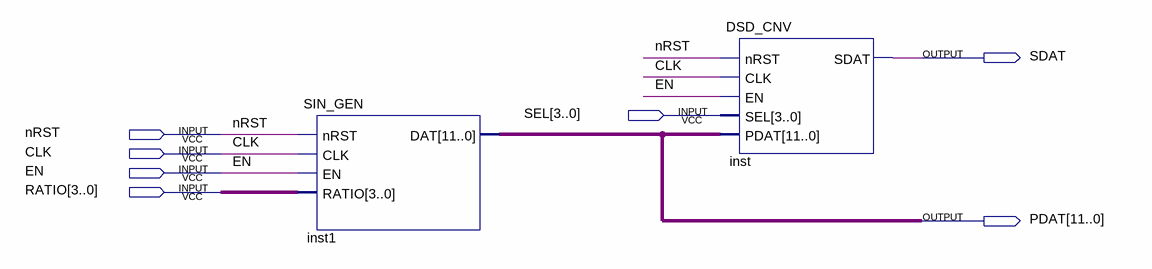
[diagram p0: schematic sheet]
// Quartus schematic SIN_DSD.bdf as structural Verilog: 2 symbols, 7 pins
module SIN_DSD (
  input  [3:0] SEL,
  input  nRST,
  input  CLK,
  input  EN,
  input  [3:0] RATIO,
  output SDAT,
  output [11:0] PDAT
);

  SIN_GEN inst1 (.nRST(nRST), .CLK(CLK), .EN(EN), .RATIO(RATIO), .DAT(PDAT));
  DSD_CNV inst (.nRST(nRST), .CLK(CLK), .EN(EN), .SEL(SEL), .PDAT(PDAT), .SDAT(SDAT));
endmodule
